# EAGLE design serial-receiver (EAGLE 6.4)
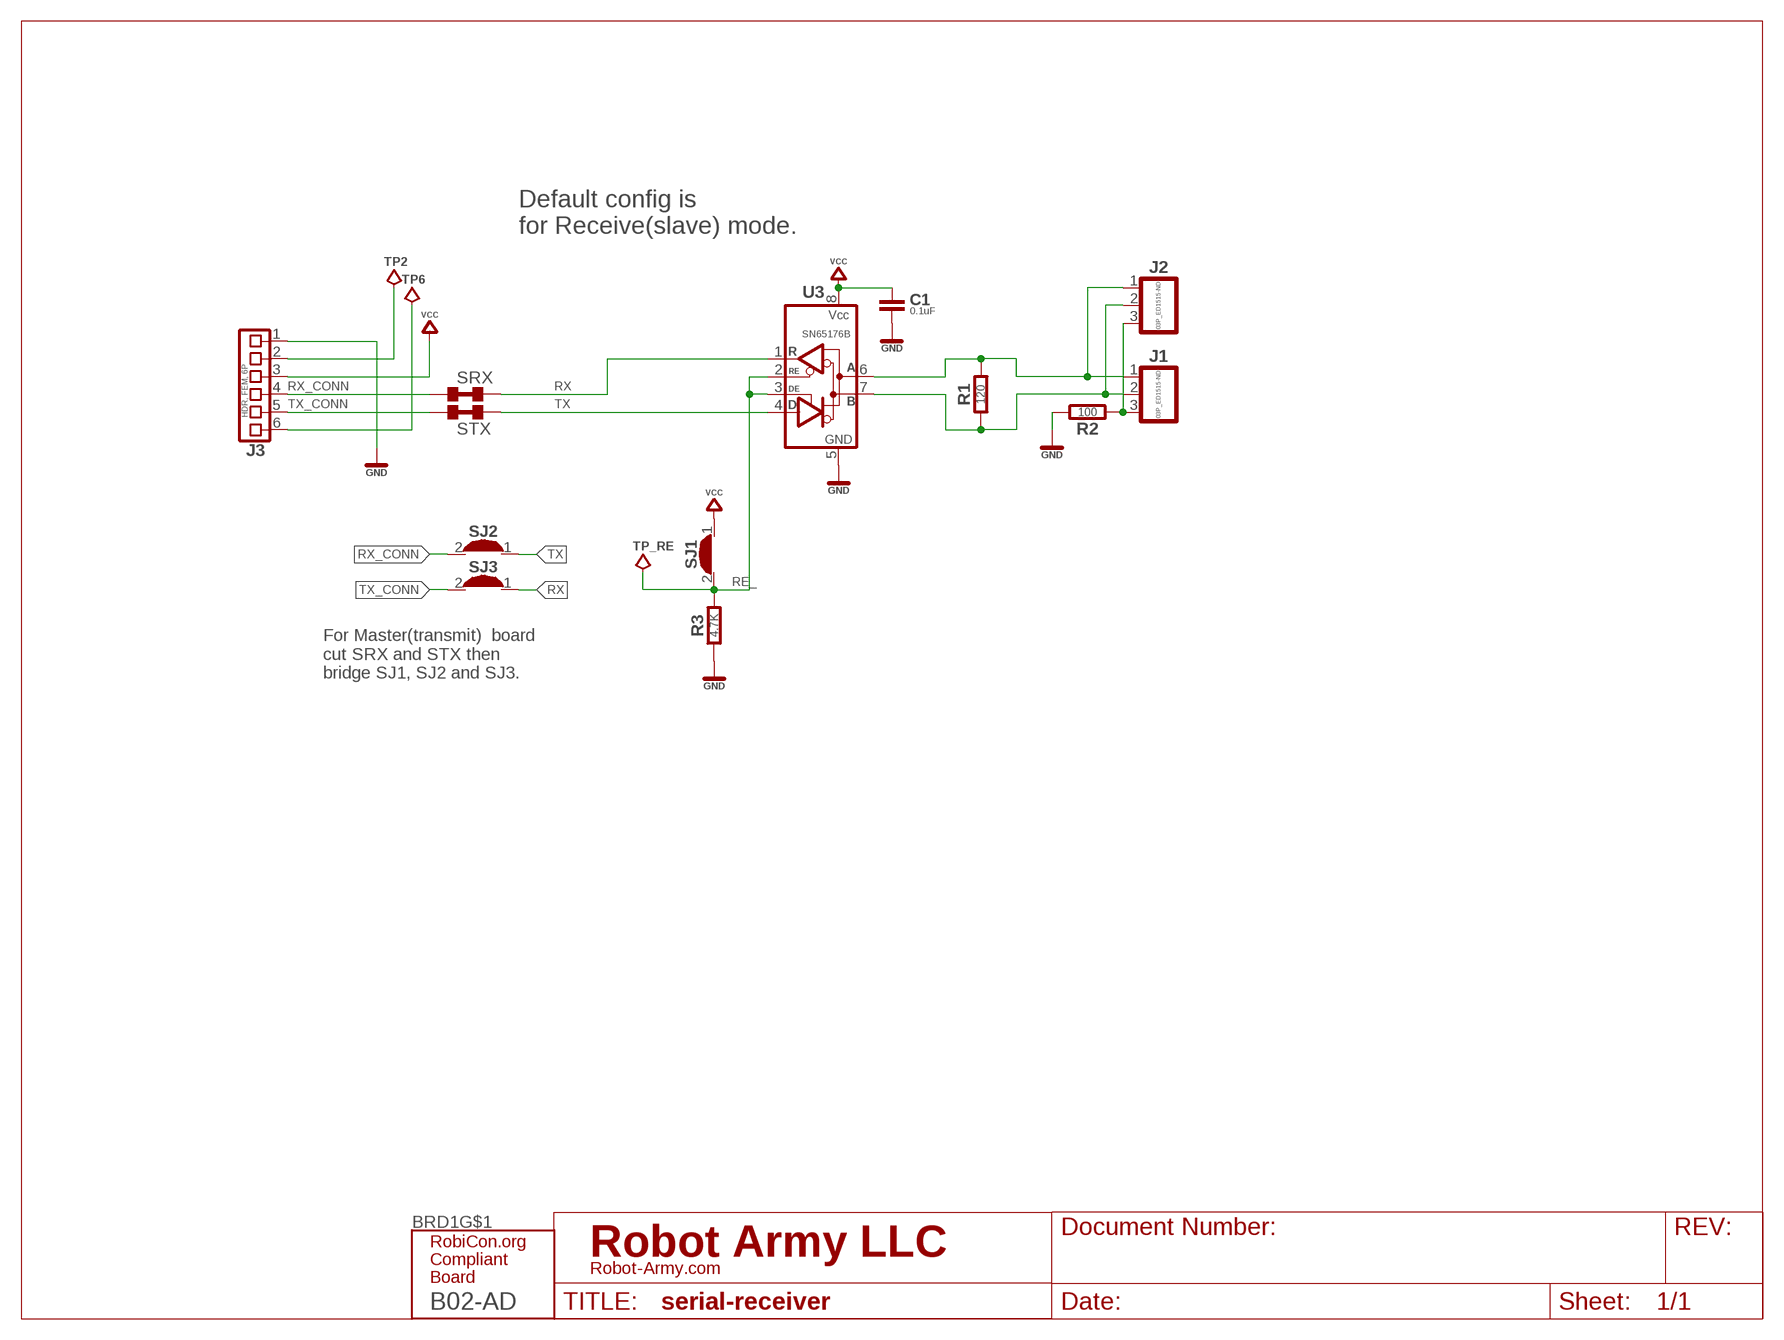
[diagram p0: schematic, sheet 1]
U$1 (LETTER_L-LIGHTPLAY): DOCUMENT_NUMBER: RA-0003-B; REV: B

## Parts
BRD1  B02-AD  BRD-B02-AD  [B02-AD]
C1  0.1uF  CAPACITOR0603  [0603]
J1  03P_ED1515-ND  [TB35-03]
J2  03P_ED1515-ND  [TB35-03]
J3  HDR, FEM, 6P  FE06-1  [FE06]
R1  120  RESISTOR1206  [1206]
R2  100  RESISTOR1206  [1206]
R3  4.7K  RESISTOR0603  [0603]
SJ1  SOLDER_JUMPER  [SOLDER_JUMP]
SJ2  SOLDER_JUMPER  [SOLDER_JUMP]
SJ3  SOLDER_JUMPER  [SOLDER_JUMP]
SRX  SHORT0603  [0603-SHORT]
STX  SHORT0603  [0603-SHORT]
TP2  TEST_POINT_SM_2X2  [TP-SMT-020X020]
TP6  TEST_POINT_SM_2X2  [TP-SMT-020X020]
TP_RE  TEST_POINT_SM_2X2  [TP-SMT-020X020]
U3  SN65176B  RS485_TRANSCEIVERSO8  [SOP08]

## Nets
A: J1.1 J2.1 R1.2 U3.6(A)
B: J1.2 J2.2 R1.1 U3.7(B)
C: J1.3 J2.3 R2.2
GND: C1.2 J3.1 R2.1 R3.1 U3.5(GND)
N$1: J3.2 TP2.1
N$2: J3.6 TP6.1
RE_: R3.2 SJ1.2 TP_RE.1 U3.2(RE) U3.3(DE)
RX: SJ3.1 SRX.2 U3.1(R)
RX_CONN: J3.4 SJ2.2 SRX.1
TX: SJ2.1 STX.2 U3.4(D)
TX_CONN: J3.5 SJ3.2 STX.1
VCC: C1.1 J3.3 SJ1.1 U3.8(VCC)

## Notes on the sheet
- Default config is 
  for Receive(slave) mode.
- For Master(transmit)  board
  cut SRX and STX then
  bridge SJ1, SJ2 and SJ3.

## Power pins joined to a net without a drawn wire
GND: BRD1.A BRD1.D

## Library data of the parts
BRD1 = robicon-boards:BRD-?-AD: Robicon Board 2-holes on long edge.; LABEL: RobiCon.org Compliant
C1 = rlc:CAPACITOR: Capacitor
J1 J2 = con-terminal_block:03P_ED1515-ND: 3.5mm - 3 pins
J3 = con-headers:FE06-1: FEMALE HEADER
R1-R3 = rlc:RESISTOR: Resistor
SJ1-SJ3 = rlc:SOLDER_JUMPER
SRX STX = rlc:SHORT: Pre-shorted SMT Resistor Pad
TP2 TP6 TP_RE = test-points:TEST_POINT: Test point
U3 = logic:RS485_TRANSCEIVER: RS485 TRANSEIVER; VALUE: ST485

## Board
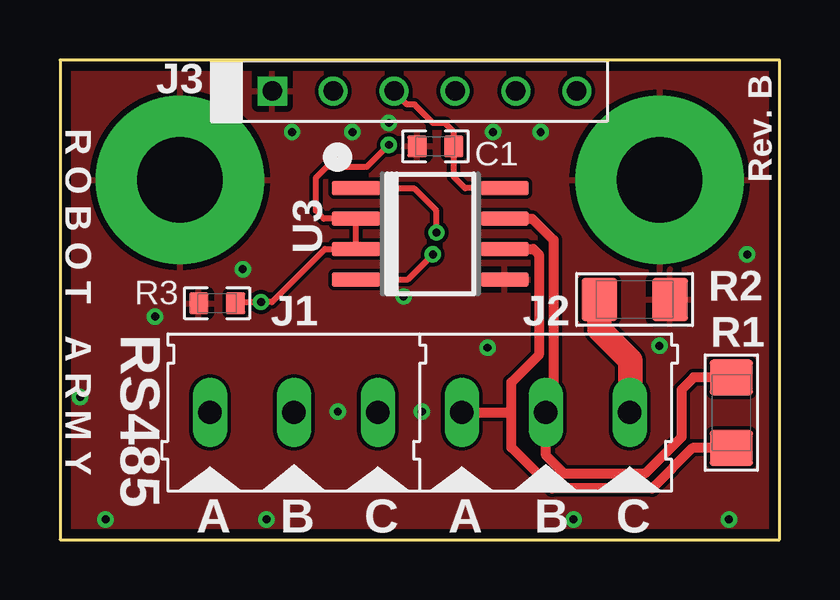
[diagram p1: board, top side]
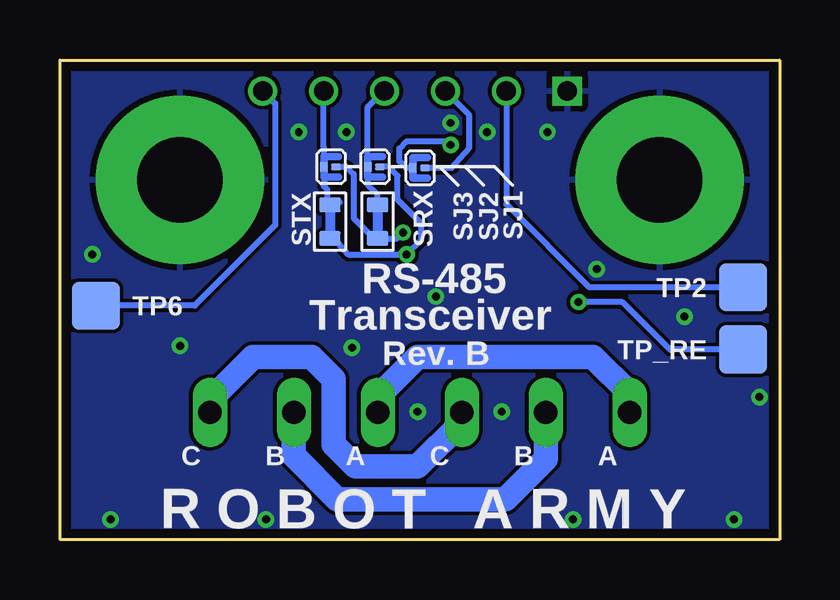
[diagram p2: board, bottom side, seen from below]

Size 30 x 20 mm. Coordinates in mm from the lower left corner, seen from the top.
Copper layers (1*16): Top 0.0356mm / dielectric 1.5011mm / Bottom 0.0356mm
Design rules "OSH-CircuitMonkey": minimum track width 6mil, minimum drill 13mil, track to track 6mil, track to pad 6mil, pad to pad 6mil, via to via 6mil, smd to smd 6mil, copper to edge 15mil, drill to drill 6mil, minimum pad ring 7mil, minimum via ring 7mil, stop-mask expansion 3mil, vias tented up to drill 13mil, thermal gap 10mil

### Footprints (pad centres in the part's own frame; a part is rotated, then mirrored left to right if it is on the bottom)
B02-AD = drill 3.569 pad 7.01: A 5,15; D 25,15
0603 = smd 0.8 x 0.9: 1 -0.763,0; 2 0.763,0
TB35-03 = drill 0.965 long: 1 -3.5,0; 2 0,0; 3 3.5,0
FE06 = drill 0.813 square: 1 -6.35,0 | drill 0.813: 2 -3.81,0; 3 -1.27,0; 4 1.27,0; 5 3.81,0; 6 6.35,0
1206 = smd 1.5 x 1.803: 1 -1.472,0; 2 1.472,0
SOLDER_JUMP = smd 0.406 x 0.254: 1 -0.254,0 | smd 0.305 x 0.406: 2 0.254,0
0603-SHORT = smd 0.6 x 0.9: 1 -0.7,0; 2 0.7,0
TP-SMT-020X020 = smd 2 x 2: 1 0,0
SOP08 = smd 0.6 x 2: 1 -1.905,-3.1; 2 -0.635,-3.1; 3 0.635,-3.1; 4 1.905,-3.1; 5 1.905,3.1; 6 0.635,3.1; 7 -0.635,3.1; 8 -1.905,3.1

### Placement (x,y rotation side)
BRD1  0,0 0 top
C1  15.65,16.4 180 top
J1  9.75,5.3 0 top
J2  20.25,5.3 0 top
J3  15.2,18.7 0 top
R1  27.99,5.29 270 top
R2  23.96,10.01 180 top
R3  6.55,9.85 0 top
SJ1  15.04,15.5 180 bottom
SJ2  16.92,15.54 180 bottom
SJ3  18.75,15.54 180 bottom
SRX  16.76,13.26 270 bottom
STX  18.75,13.26 270 bottom
TP2  1.52,10.52 180 bottom
TP6  28.5,9.75 0 bottom
TP_RE  1.52,7.92 180 bottom
U3  15.44,12.75 270 top

### Tracks (layer width: path | path; a pad name or v marks a point on that pad's centre or on a via)
A
  Top 0.406: U3.6 19.74,12.12 19.96,11.89 19.96,7.7 18.82,6.55 18.82,5.49 | 18.82,5.49 18.82,3.84 20.53,2.13 24.69,2.13 26.37,3.82 R1.2 | J2.1 18.64,5.3 arc90 18.82,5.49
  Bottom 1.016: J1.1 | J1.1 6.25,6.1 7.77,7.62 15.09,7.62 16.76,5.94 16.76,5.31 J2.1 | J1.1
B
  Top 0.406: U3.7 19.69,13.38 20.57,12.5 20.57,5.62 J2.2 20.27,5.28 20.27,3.5 21.03,2.74 24.38,2.74 25.91,4.27 25.91,6.25 26.42,6.76 R1.1
  Bottom 0.406: 20.27,5.28 J2.2
  Bottom 1.016: J1.2 9.75,3.36 11.43,1.68 18.44,1.68 20.27,3.5 20.27,5.28
C
  Top 0.406: 23.77,5.28 J2.3 23.77,5.32
  Top 1.016: R2.2 22.49,8.75 23.77,7.47 23.77,5.32
  Bottom 1.016: J1.3 13.25,4.89 15.09,3.05 17.68,3.05 18.59,3.96 18.59,6.71 19.51,7.62 21.95,7.62 23.77,5.79 J2.3
GND  (via drill 0.33)
  other vias: 11.58,5.33 15.09,5.33 1.91,0.84 27.89,0.84 21.41,0.84 8.61,0.84 24.99,8.08 28.65,11.89 0.84,5.94 13.72,17.37 12.19,16.99 9.68,16.99 18.06,16.99 20.04,16.99 3.96,9.3 7.62,11.28 14.33,10.13 17.83,8
  pour Top: 0,20 30,20 30,0 0,0
  pour Bottom: 0,20 30,20 30,0 0,0
N$1
  Bottom 0.254: TP2.1 7.92,10.52 11.39,13.98 J3.2
N$2
  Bottom 0.254: J3.6 21.03,18.18 21.03,13.11 24.38,9.75 TP6.1
RE_  (via drill 0.33)
  Top 0.254: v13.72,16.46 12.8,15.54 11.12,15.54 10.67,15.09 10.67,13.72 11,13.38 U3.2 U3.3 11.05,12.12 8.84,9.91 v8.38,9.91 7.37,9.91 R3.2
  Bottom 0.152: 8.33,9.91 v8.38,9.91
  Bottom 0.254: SJ1.2 15.57,15.5 15.85,15.77 15.85,16.31 15.54,16.61 13.87,16.61 v13.72,16.46 | TP_RE.1 4.57,7.92 6.55,9.91 8.33,9.91 8.38,9.85
RX  (via drill 0.33)
  Top 0.254: v15.7,12.8 15.7,13.72 14.78,14.63 12.37,14.63 U3.1
  Bottom 0.254: SJ3.1 18.06,15.54 17.75,15.24 17.75,13.4 16.93,12.57 16.84,12.57 SRX.2 15.94,12.56 v15.7,12.8
RX_CONN
  Bottom 0.254: J3.4 16.5,18.7 17.17,18.03 SJ2.2 17.17,14.81 16.76,14.4 SRX.1
TX  (via drill 0.33)
  Top 0.254: U3.4 14.5,10.85 v15.54,11.89
  Bottom 0.254: STX.2 18.58,12.56 17.98,11.89 v15.54,11.89 14.94,12.5 14.94,13.18 15.93,14.17 15.93,15.16 16.31,15.54 SJ2.1
TX_CONN
  Bottom 0.254: 18.34,14.06 STX.1 18.85,14.06 18.85,14.58 19,14.73 SJ3.2 19,16.36 19.01,16.37 J3.5
VCC
  Top 0.254: U3.8 16.89,14.65 16.41,15.13 C1.1 16.41,17.01 16.05,17.37 15.54,17.37 14.78,18.14 14.48,18.14 13.93,18.68 J3.3
  Bottom 0.254: J3.3 12.95,17.72 12.95,16.31 13.67,15.5 SJ1.1

### Text on the board
tPlace: Rev. B | R O B O T A R M Y | RS485 | A | B | C | A | B | C
bPlace: RS-485 | Transceiver | Rev. B | A | B | C | A | B | C | R O B O T A R M Y